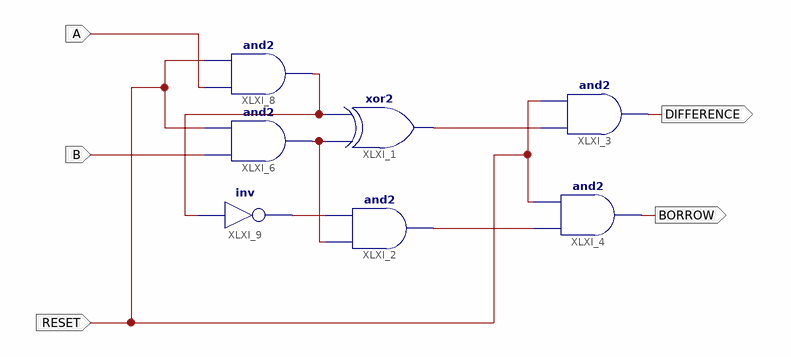
[diagram p0: schematic sheet 1]
// Xilinx ISE schematic HS.sch (spartan6) as structural Verilog: 7 symbols, 5 ports
module HS (
  input  RESET,
  input  B,
  input  A,
  output BORROW,
  output DIFFERENCE
);

  wire XLXN_1, XLXN_2, XLXN_5, XLXN_7, XLXN_10;

  xor XLXI_1 (XLXN_1, XLXN_5, XLXN_7);
  and XLXI_2 (XLXN_2, XLXN_5, XLXN_10);
  and XLXI_3 (DIFFERENCE, XLXN_1, RESET);
  and XLXI_4 (BORROW, XLXN_2, RESET);
  and XLXI_6 (XLXN_5, B, RESET);
  and XLXI_8 (XLXN_7, A, RESET);
  not XLXI_9 (XLXN_10, XLXN_7);
endmodule
